# Altium schematic sheet Total.SchDoc: XTRX. SDR mini PCIe Transceiver.
size A4 portrait; CompanyName: Fairwaves Inc; DrawnBy: Andrey Sviyazov; Revision: 4; SheetNumber: 2; SheetTotal: 5
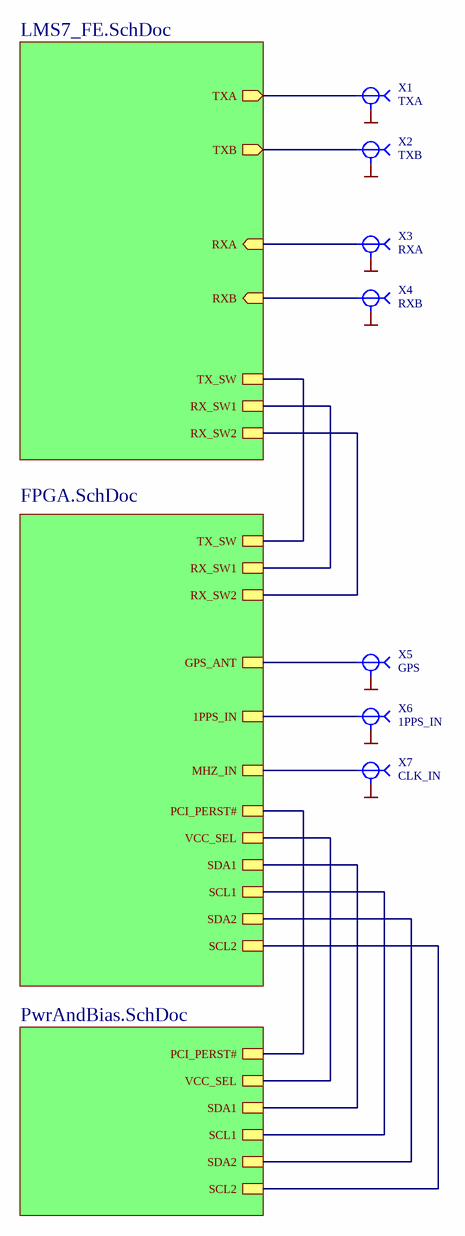
[diagram p0: Total.SchDoc]

## Parts
X1  Label: TXA  [U_FL]
X2  Label: TXB  [U_FL]
X3  Label: RXA  [U_FL]
X4  Label: RXB  [U_FL]
X5  Label: GPS  [U_FL]
X6  Label: 1PPS_IN  [U_FL]
X7  Label: CLK_IN  [U_FL]

## Sub-sheets
FPGA = FPGA.SchDoc: 1PPS_IN, GPS_ANT, MHZ_IN, RX_SW1, RX_SW2, TX_SW, SCL1, SDA1, SDA2, SCL2, VCC_SEL, PCI_PERST#
LMS7_FE = LMS7_FE.SchDoc: TXB (out), TXA (out), RXB (in), RXA (in), RX_SW1, RX_SW2, TX_SW
PwrAndBias = PwrAndBias.SchDoc: SCL1, SDA1, SDA2, SCL2, VCC_SEL, PCI_PERST#

## Nets
GND: X1.2(GND) X2.2(GND) X3.2(GND) X4.2(GND) X5.2(GND) X6.2(GND) X7.2(GND)
NetX1_1: X1.1 ; sheet LMS7_FE/TXA
NetX2_1: X2.1 ; sheet LMS7_FE/TXB
NetX3_1: X3.1 ; sheet LMS7_FE/RXA
NetX4_1: X4.1 ; sheet LMS7_FE/RXB
NetX5_1: X5.1 ; sheet FPGA/GPS_ANT
NetX6_1: X6.1 ; sheet FPGA/1PPS_IN
NetX7_1: X7.1 ; sheet FPGA/MHZ_IN
(unnamed): sheet PwrAndBias/SCL1, sheet FPGA/SCL1
(unnamed): sheet PwrAndBias/SDA1, sheet FPGA/SDA1
(unnamed): sheet PwrAndBias/SDA2, sheet FPGA/SDA2
(unnamed): sheet PwrAndBias/SCL2, sheet FPGA/SCL2
(unnamed): sheet PwrAndBias/VCC_SEL, sheet FPGA/VCC_SEL
(unnamed): sheet PwrAndBias/PCI_PERST#, sheet FPGA/PCI_PERST#
(unnamed): sheet FPGA/RX_SW1, sheet LMS7_FE/RX_SW1
(unnamed): sheet FPGA/RX_SW2, sheet LMS7_FE/RX_SW2
(unnamed): sheet FPGA/TX_SW, sheet LMS7_FE/TX_SW

## Library data of the parts
X1-X7 = U_FL: Connector (UMCC); Manufacturer: Molex; Name: UFL; Value: 0734120110; Link: https://octopart.com/0734120110-molex-16756629